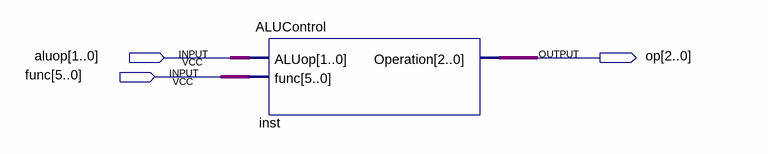
[diagram p0: schematic sheet]
// Quartus schematic test_alucontrol.bdf as structural Verilog: 1 symbols, 3 pins
module test_alucontrol (
  input  [1:0] aluop,
  input  [5:0] func,
  output [2:0] op
);

  ALUControl inst (.ALUop(aluop), .func(func), .Operation(op));
endmodule
